# Altium schematic sheet BLE-NTC.SchDoc: BLE-NTC
size A4; Organization: Micro Device Tunisie; Address1: Pépinière d’Entreprises Sousse-Tec; Address2: Espace Universitaire ISET SOUSSE; Address3: Cité Erriadh, 4023, Tunisia; Address4: contact@mdtunisie.com
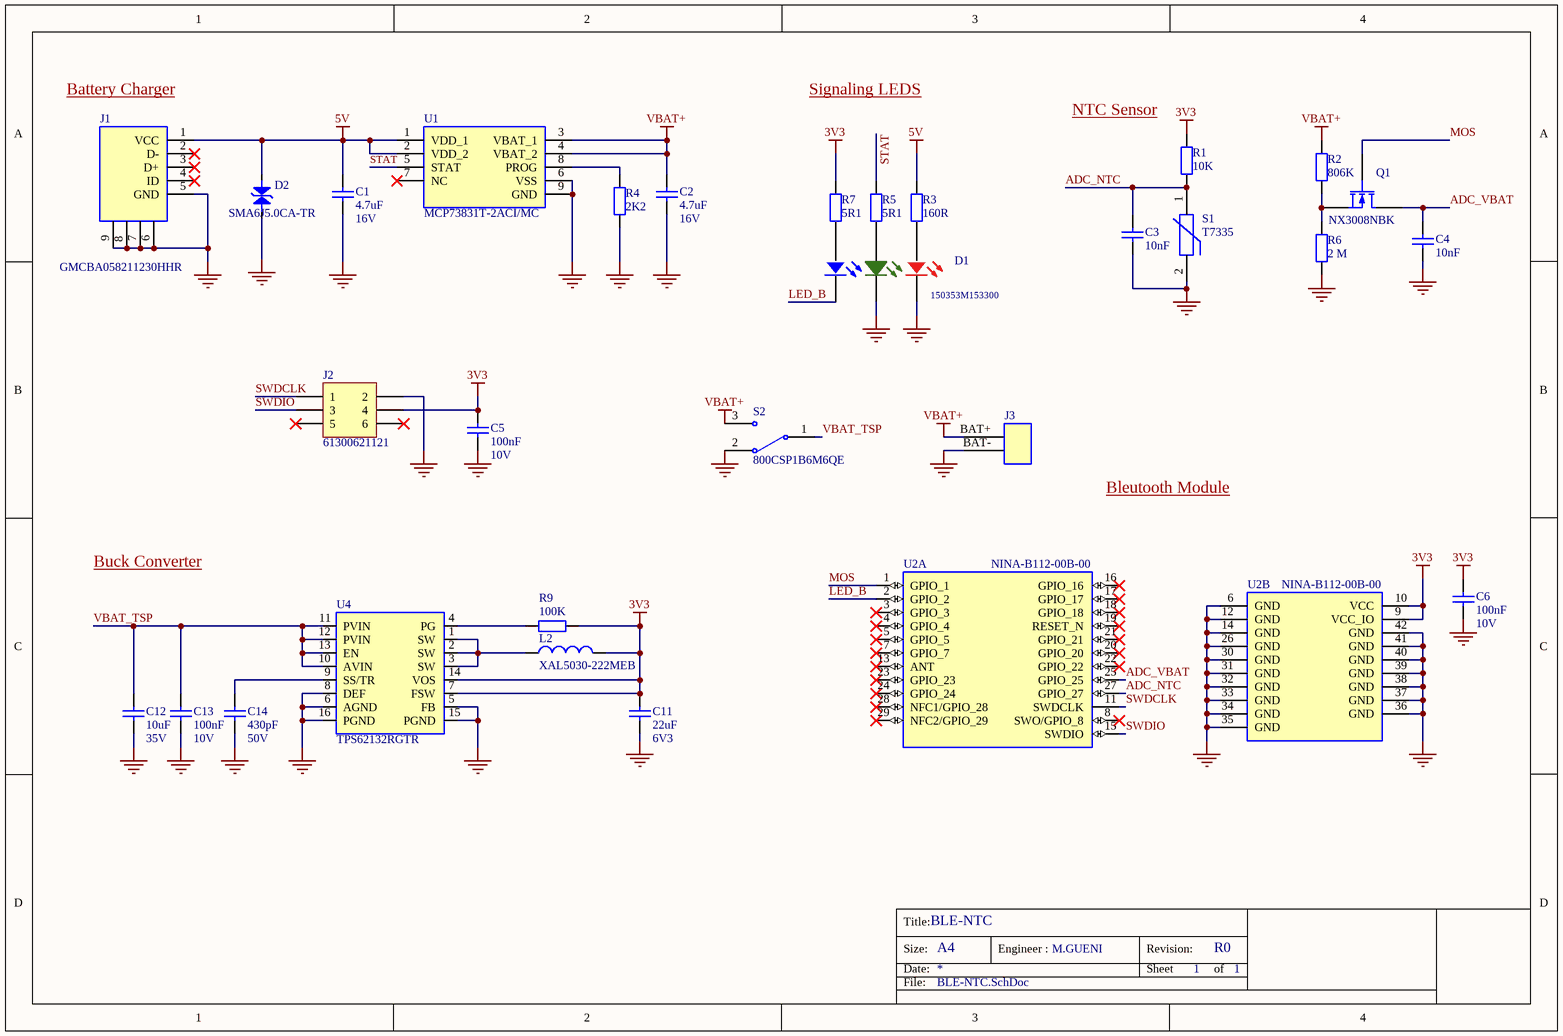
[diagram p0: BLE-NTC.SchDoc]

## Parts
C1  Value 1: 4.7uF  Value 2: 16V  [CAPC1608N]  (hidden comment: Capacitor)
C2  Value 1: 4.7uF  Value 2: 16V  [CAPC1608N]  (hidden comment: Capacitor)
C3  Value 1: 10nF  [CAPC1608N]  (hidden comment: Capacitor)
C4  Value 1: 10nF  [CAPC1608N]  (hidden comment: Capacitor)
C5  Value 1: 100nF  Value 2: 10V  [CAPC1608N]  (hidden comment: Capacitor)
C6  Value 1: 100nF  Value 2: 10V  [CAPC1608N]  (hidden comment: Capacitor)
C11  Value 1: 22uF  Value 2: 6V3  [CAPC1608N]  (hidden comment: Capacitor)
C12  Value 1: 10uF  Value 2: 35V  [CAPC1608N]  (hidden comment: Capacitor)
C13  Value 1: 100nF  Value 2: 10V  [CAPC1608N]  (hidden comment: Capacitor)
C14  Value 1: 430pF  Value 2: 50V  [CAPC1608N]  (hidden comment: Capacitor)
D1  150353M153300  [150353M153300]
D2  SMA6J5.0CA-TR  [SMA6J5.0CA-TR]
J1  GMCBA058211230HHR  [GMCBA058211230HHR]
J2  61300621121  [HDR2X3]
J3  BAT_PAD  [BAT_PAD]  (value not drawn)
L2  XAL5030-222MEB  [22uh-XAL5030]
Q1  NX3008NBK  [SOT23-3N]
R1  Value 1: 10K  [RESC1608N]  (hidden comment: Resistor)
R2  Value 1: 806K  [RESC1608N]  (hidden comment: Resistor)
R3  Value 1: 160R  [RESC1608N]  (hidden comment: Resistor)
R4  Value 1: 2K2  [RESC1608N]  (hidden comment: Resistor)
R5  Value 1: 5R1  [RESC1608N]  (hidden comment: Resistor)
R6  Value 1: 2 M  [RESC1608N]  (hidden comment: Resistor)
R7  Value 1: 5R1  [RESC1608N]  (hidden comment: Resistor)
R9  Value 1: 100K  [RESC1608N]  (hidden comment: Resistor)
S1  T7335  [T7335D]
S2  800CSP1B6M6QE  [800CSP1B6M6QE]
U1  MCP73831T-2ACI/MC  [mcp-SON50P300X200X100-9N-D]
U2  NINA-B112-00B-00  [NINAB112]  (parts A,B of 2)
U4  TPS62132RGTR  [tps62132]

## Nets
3V3: C5.2 C6.2 C11.2 J2.4 L2.2 R1.2 R7.2 R9.2 U2.9(VCC_IO) U2.10(VCC) U4.7(FSW) U4.14(VOS)
5V: C1.1 D2.2(K1A2) J1.1(VCC) R3.2 U1.1(VDD_1) U1.2(VDD_2)
GND: C1.2 C2.2 C3.1 C4.1 C5.1 C6.1 C11.1 C12.1 C13.1 C14.1 D1.2(K) D1.4(K) D2.1 J1.5(GND) J1.6 J1.7 J1.8(Shield) J1.9 J2.2 J3.BAT- R4.2 R6.2 S1.2 S2.2 U1.6(VSS) U1.9(GND) U2.6(GND) U2.12(GND) U2.14(GND) U2.26(GND) U2.30(GND) U2.31(GND) U2.32(GND) U2.33(GND) U2.34(GND) U2.35(GND) U2.36(GND) U2.37(GND) U2.38(GND) U2.39(GND) U2.40(GND) U2.41(GND) U2.42(GND) U4.5(FB) U4.6(AGND) U4.8(DEF) U4.15(PGND) U4.16(PGND)
VBAT+: C2.1 J3.BAT+ R2.2 S2.3 U1.3(VBAT_1) U1.4(VBAT_2)
ADC_NTC: C3.2 R1.1 S1.1 U2.27(GPIO_27)
ADC_VBAT: C4.2 Q1.3(D) U2.25(GPIO_25)
LED_B: D1.6(K) U2.2(GPIO_2)
MOS: Q1.1(G) U2.1(GPIO_1)
STAT: R5.2 U1.5(STAT)
SWDCLK: J2.1 U2.11(SWDCLK)
SWDIO: J2.3 U2.15(SWDIO)
VBAT_TSP: C12.2 C13.2 S2.1 U4.10(AVIN) U4.11(PVIN) U4.12(PVIN) U4.13(EN)
NetC14_2: C14.2 U4.9(SS/TR)
NetD1_1: D1.1(A) R3.1
NetD1_3: D1.3(A) R5.1
NetD1_5: D1.5(A) R7.1
NetL2_1: L2.1 U4.1(SW) U4.2(SW) U4.3(SW)
NetQ1_2: Q1.2(S) R2.1 R6.1
NetR4_1: R4.1 U1.8(PROG)
NetR9_1: R9.1 U4.4(PG)

Not connected (* = marked no-connect by the designer): J1 2(D-)* 3(D+)* 4(ID)*; J2 5* 6*; U1 7(NC)*; U2 3(GPIO_3)* 4(GPIO_4)* 5(GPIO_5)* 7(GPIO_7)* 8(SWO/GPIO_8)* 13(ANT)* 16(GPIO_16)* 17(GPIO_17)* 18(GPIO_18)* 19(RESET_N)* 20(GPIO_20)* 21(GPIO_21)* 22(GPIO_22)* 23(GPIO_23)* 24(GPIO_24)* 28(NFC1/GPIO_28)* 29(NFC2/GPIO_29)*

## Notes on the sheet
- (near J1) Battery Charger
- Signaling LEDS
- (near R1) NTC Sensor
- Bleutooth Module
- Buck Converter
- Title:
- BLE-NTC
- Size:
- Date:
- File:
- A4
- Engineer :
- M.GUENI
- Revision:
- Sheet
- 1
- R0
- of

## Library data of the parts
C1 C2 = CAP-000000047: MAN: Murata Electronics; MANREF: GRM188C71C475KE21D; DES: Multilayer Ceramic Capacitors MLCC - SMD/SMT 4.7UF 16V 10% 0603; TOL: 10%; FTP: 0603; SUP: Mouser; SUPREF: 81-GRM188C71C475KE1D; NOTE: _; Part Number: CAP-000000047
C3 C4 = CAP-000000003: MAN: MULTICOMP; MANREF: 06035C103JAT2A; DES: 06035C103JAT2A -  Condensateur céramique multicouche CMS, 10000 pF, 50 V, 0603 [1608 Metric], ± 5%, X7R; Value 2: 50V; TOL: 5%; FTP: 0603; SUP: Farnell; SUPREF: 1833871; NOTE: _; Part Number: CAP-000000003
C5 C6 C13 = CAP-000000005: MAN: KEMET; MANREF: C0603X104K8RACTU; DES: C0603X104K8RACTU -  Condensateur céramique multicouche CMS, 0.1 µF, 10 V, 0603 [1608 Metric], ± 10%, X7R; TOL: 10%; FTP: 0603; SUP: Farnell; SUPREF: 2904937; NOTE: _; Part Number: CAP-000000005
C11 = CAP-000000045: MAN: Murata Electronics; MANREF: GRM188R60J226MEA0D; DES: Multilayer Ceramic Capacitors MLCC - SMD/SMT 0603 22uF 6.3volts *Derate Voltage/Temp; TOL: 20%; FTP: 0603; SUP: Mouser; SUPREF: 81-GRM188R60J226ME0D; NOTE: In Stock; Part Number: CAP-000000045
C12 = CAP-000000006: MAN: Murata Electronics; MANREF: GRM188R6YA106MA73D; DES: Multilayer Ceramic Capacitors MLCC - SMD/SMT 0603 10uF 35volts *Derate Voltage/Temp; TOL: 20%; FTP: 0603; SUP: Mouser; SUPREF: 81-GRM188R6YA106MA3D; NOTE: _; Part Number: CAP-000000006
C14 = CAP-000000044: MAN: KEMET; MANREF: C0603C431G5GACTU; DES: Multilayer Ceramic Capacitors MLCC - SMD/SMT 50V 430pF 0603 C0G 0.02; TOL: 2%; FTP: 0603; SUP: Mouser; SUPREF: 80-C0603C431G5G; NOTE: In Stock; Part Number: CAP-000000044
D1 = LED-000000004: MAN: Wurth Elektronik; DES: WL-SFTW SMD Full-color TOP LED Waterclear, size 5050, Red & Green & Blue, 120deg; Value 1: 100 mA; Value 2: _; SUP: Mouser; SUPREF: 710-150353M153300; NOTE: In Stock; Part Number: LED-000000004; MANREF: 150353M153300; TOL: _; FTP: _
D2 = TVS-000000006: MAN: STMicroelectronics; DES: ESD Suppressors / TVS Diodes HJ Temp Transil / ESD Suppressors / TVS Diodes HJ Temp Transil; Value 1: 13.4 V; Value 2: 600W; TOL: _; FTP: SMA; SUP: Mouser; SUPREF: 511-SMA6J5.0CA-TR; NOTE: In Stock; Part Number: TVS-000000006; MANREF: SMA6J5.0CA-TR
J1 = CON-000000037: MAN: Amphenol Commercial Products; DES: USB Connectors USB MICRO B TYPE RECPT; Value 1: _; FTP: SMD; SUP: Mouser; SUPREF: 523-GMCBA05821123HHR; NOTE: In Stock; Part Number: CON-000000037; MANREF: GMCBA058211230HHR; Value 2: _; TOL: _
J2 = CON-000000012: MAN: Wurth Electronics; DES: Embases et logements de câbles WR-PHD 2.54mm Hdr 6P Dual Str Gold; Value 1: 6pts; Value 2: _; FTP: THT; SUP: Mouser; SUPREF: 710-61300621121; NOTE: In Stock; Part Number: CON-000000012; MANREF: 61300621121; TOL: _
J3 = MIS-000000024: MAN: _; Part Number: MIS-000000024; MANREF: _; DES: _; Value 1: _; TOL: _; FTP: _; SUP: _; SUPREF: _; NOTE: _
L2 = IND-000000001: MAN: Coilcraft; DES: Fixed Inductors 2.2uH 20% 9.7A 14.5mOhms AEC-Q200; Value 1: 2.2uH; Value 2: 9.2 A; TOL: 20 %; FTP: _; SUP: Mouser; SUPREF: 994-XAL5030-222MEB; NOTE: In Stock; Part Number: IND-000000001; MANREF: XAL5030-222MEB
Q1 = TRM-000000001: MAN: NXP; DES: NXP  NX3008NBK  MOSFET, N CH, 30V, 400MA, SOT23; Value 1: 400mA; Value 2: 30V; TOL: _; FTP: SOT-23; SUP: Farnell; SUPREF: 2069541; NOTE: In Stock; Part Number: TRM-000000001; MANREF: NX3008NBK
R1 = RES-000000001: MAN: YAGEO; MANREF: RC0603FR-0710KL; DES: YAGEO (PHYCOMP)  RC0603FR-0710KL  RESISTANCE COUCHE EPAISSE 10K 0.1W 1%; Value 2: 0.1W; TOL: 1%; FTP: 0603; SUP: Farnell; SUPREF: 9238603; NOTE: _; Part Number: RES-000000001
R2 = RES-00000011s3: MAN: Bourns; MANREF: CR0603-FX-8063ELF; DES: Thick Film Resistors 806KOHM 1/10WATT 1%; Value 2: 0.1W; TOL: 1%; FTP: 0603; SUP: Mouser; SUPREF: 652-CR0603-FX8063ELF; NOTE: In Stock; Part Number: RES-00000011s3
R3 = RES-000000098: MAN: Vishay / Dale; MANREF: CRCW0603160RFKEA; DES: Thick Film Resistors 1/10watt 160ohms 1%; Value 2: 0,1W; TOL: 1%; FTP: 0603; SUP: Mouser; SUPREF: 71-CRCW0603-160-E3; NOTE: In Stock; Part Number: RES-000000098
R4 = RES-000000009: MAN: YAGEO; MANREF: RC0603FR-072K2L; DES: YAGEO (PHYCOMP)  RC0603FR-072K2L  RESISTANCE COUCHE EPAISSE 2.2K 0.1W 1%; Value 2: 0.1W; TOL: 1%; FTP: 0603; SUP: Farnell; SUPREF: 9238522; NOTE: _; Part Number: RES-000000009
R5 R7 = RES-000000097: MAN: Vishay / Dale; MANREF: CRCW06035R10JNEA; DES: Thick Film Resistors 1/10watt 5.1ohms 5%; Value 2: 10W; TOL: 5%; FTP: 0603; SUP: Mouser; SUPREF: 71-CRCW0603J-5.1-E3; NOTE: In Stock; Part Number: RES-000000097
R6 = RES-00000011d2: MAN: Vishay / Beyschlag; MANREF: MCT06030C2004FP500; DES: Thin Film Resistors .1W 2Mohms 1% 0603 50ppm; Value 2: 0.125W; TOL: 1%; FTP: 0603; SUP: Mouser; SUPREF: 594-MCT06030C2004FP5; NOTE: In Stock; Part Number: RES-00000011d2
R9 = RES-000000038: MAN: YAGEO; MANREF: RC0603FR-07100KL; DES: YAGEO (PHYCOMP)  RC0603FR-07100KL  RESISTANCE COUCHE EPAISSE 100K 0.1W 1%; Value 2: 0.1W; TOL: 1%; FTP: 0603; SUP: Farnell; SUPREF: 9238727; NOTE: _; Part Number: RES-000000038
S1 = MIS-000000023: MAN: Honeywell; MANREF: T7335 D1008; DES: Negative temperature coefficient thermistor; Value 1: _; Part Number: MIS-000000023; Value 2: _; TOL: _; FTP: _; SUP: _; SUPREF: _; NOTE: _
S2 = SWC-000000006: MAN: E-Switch; DES: Pushbutton Switches SPDT ON-ON PC MNT; Value 1: _; Part Number: SWC-000000006; MANREF: 800CSP1B6M6QE; Value 2: _; TOL: _; FTP: _; SUP: E-Switch; SUPREF: 800CSP1B6M6QE; NOTE: _
U1 = ICP-000000011: MAN: Microchip Technology; DES: Battery Management Charge mgnt contr / Battery Management Charge mgnt contr; Value 1: _; FTP: DFN; SUP: Mouser; SUPREF: 579-MCP73831T-2ACIMC; NOTE: In Stock; Part Number: ICP-000000011; MANREF: MCP73831T-2ACI/MC; Value 2: _; TOL: _
U2 = RFC-000000004: MAN: U-Blox; DES: MOD BLE 5.0 NORDIC NRF52832 SOC; Value 1: _; SUP: Digi-Key; SUPREF: 672-NINA-B112-00B-00CT-ND; NOTE: In Stock; Part Number: RFC-000000004; MANREF: NINA-B112-00B-00; Value 2: _; TOL: _; FTP: _
U4 = ICP-000000010: MAN: Texas Instruments; DES: Switching Voltage Regulators 3-17V 3A SD Cnvrtr; Value 1: _; FTP: VQFN-16; SUP: Mouser; SUPREF: 595-TPS62132RGTR; NOTE: In Stock; Part Number: ICP-000000010; MANREF: TPS62132RGTR; Value 2: _; TOL: _